# EAGLE design DomOS V2 (EAGLE 6.5.0)
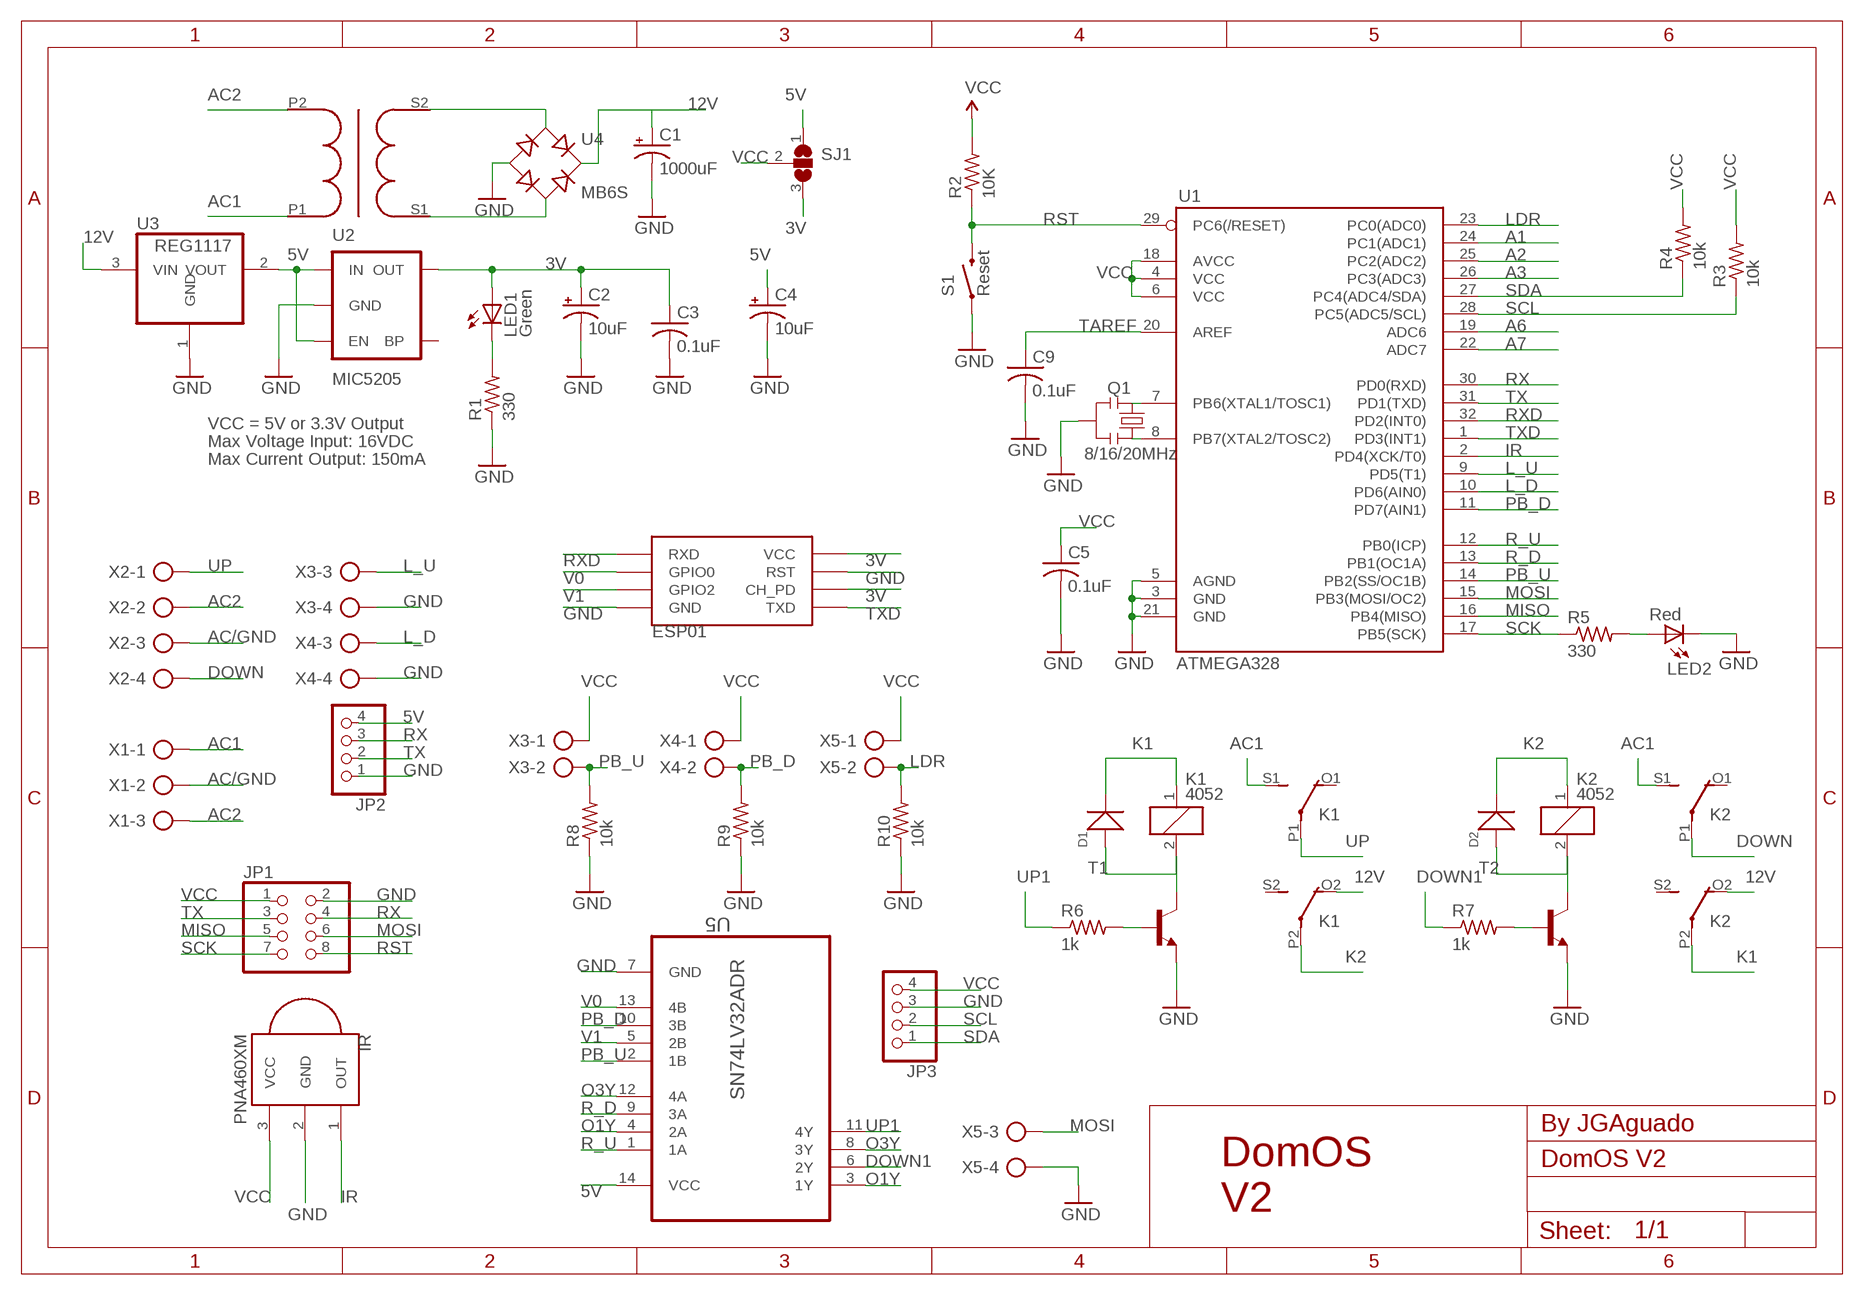
[diagram p0: schematic, sheet 1]

## Parts
C1  1000uF  CPOL-US140CLH-0810  [140CLH-0810]
C2  10uF  CAP_POL1206  [EIA3216]
C3  0.1uF  C-USC1206  [C1206]
C4  10uF  CAP_POL1206  [EIA3216]
C5  0.1uF  C-USC1206  [C1206]
C9  0.1uF  C-USC1206  [C1206]
D1  SMD-DIODE-SWITCHING-75V-150MA(D1206)  [LED-1206]
D2  SMD-DIODE-SWITCHING-75V-150MA(D1206)  [LED-1206]
ESP01  ESP01  [ESP01]
IR  PNA460XM  [PNA460XM]
JP1  PINHD-2X4  [2X04]
JP2  PINHD-1X4  [1X04]
JP3  PINHD-1X4  [1X04]
K1  4052  [F4052]
K2  4052  [F4052]
LED1  Green  LEDSMT1206  [1206]
LED2  Red  LEDSMT1206  [1206]
Q1  8/16/20MHz  RESONATORSMD  [RESONATOR-SMD]
R1  330  R-US_R1206  [R1206]
R2  10K  R-US_R1206  [R1206]
R3  10k  R-US_R1206  [R1206]
R4  10k  R-US_R1206  [R1206]
R5  330  R-US_R1206  [R1206]
R6  1k  R-US_R1206  [R1206]
R7  1k  R-US_R1206  [R1206]
R8  10k  R-US_R1206  [R1206]
R9  10k  R-US_R1206  [R1206]
R10  10k  R-US_R1206  [R1206]
S1  Reset  SWITCH-MOMENTARY-2SMD-4  [TACTILE_SWITCH_TALL]
SJ1  SJ2W  [SJ_2]
T1  BC817-16-NPN-SOT23-BEC  [SOT23-BEC]
T2  BC817-16-NPN-SOT23-BEC  [SOT23-BEC]
U1  ATMEGA328  ATMEGA168  [TQFP32-08]
U2  MIC5205  V_REG_LDOSMD  [SOT23-5]
U3  REG1117  [SOT223]
U4  MB6S  [SOIC-4]
U5  SN74LV32ADR  SN74S32D  [SOIC127P600X175-14N]
U$1  TRANSFORMADOR_PE3010-M  [TRANSFORMADOR_PE3010-M]
X1  AK500/3  [AK500/3]
X2  AK500/4  [AK500/4]
X3  AK500/4  [AK500/4]
X4  AK500/4  [AK500/4]
X5  AK500/4  [AK500/4]

## Nets
3V: C2.A(+) C3.1 ESP01.CH_PD ESP01.VCC LED1.A SJ1.3 U2.5(OUT)
5V: C4.A(+) JP2.4 SJ1.1 U2.1(IN) U2.3(EN) U3.2(VOUT) U5.14(VCC)
12V: C1.+ K1.O2(3:O) K2.O2(3:O) U3.3(VIN) U4.+
A1: U1.24(PC1(ADC1))
A2: U1.25(PC2(ADC2))
A3: U1.26(PC3(ADC3))
A6: U1.19(ADC6)
A7: U1.22(ADC7)
AC1: K1.S1(2:S) K2.S1(2:S) U$1.P1 X1.1
AC2: U$1.P2 X1.3 X2.2
AC/GND: X1.2 X2.3
DOWN: K2.P1(2:P) X2.4
DOWN1: R7.1 U5.6(2Y)
GND: C1.- C2.C(-) C3.2 C4.C(-) C5.2 C9.2 ESP01.GND ESP01.RST IR.2(GND) JP1.2 JP2.1 JP3.3 LED2.C Q1.2 R1.1 R8.1 R9.1 R10.1 S1.A2 T1.E T2.E U1.3(GND) U1.5(AGND) U1.21(GND) U2.2(GND) U3.1(GND) U4.- U5.7(GND) X3.4 X4.4 X5.4
IR: IR.1(OUT) U1.2(PD4(XCK/T0))
K1: D1.- K1.1 K2.P2(3:P)
K2: D2.- K1.P2(3:P) K2.1
L_D: U1.10(PD6(AIN0)) X4.3
L_U: U1.9(PD5(T1)) X3.3
LDR: R10.2 U1.23(PC0(ADC0)) X5.2
MISO: JP1.5 U1.16(PB4(MISO))
MOSI: JP1.6 U1.15(PB3(MOSI/OC2)) X5.3
N$1: U4.~1(AC1) U$1.S2
N$2: U4.~2(AC2) U$1.S1
N$3: D1.+ K1.2 T1.C
N$5: Q1.3 U1.8(PB7(XTAL2/TOSC2))
N$6: Q1.1 U1.7(PB6(XTAL1/TOSC1))
N$7: LED2.A R5.2
N$8: LED1.C R1.2
N$9: R6.2 T1.B
N$16: D2.+ K2.2 T2.C
N$17: R7.2 T2.B
O1Y: U5.3(1Y) U5.4(2A)
O3Y: U5.8(3Y) U5.12(4A)
PB_D: R9.2 U1.11(PD7(AIN1)) U5.10(3B) X4.2
PB_U: R8.2 U1.14(PB2(SS/OC1B)) U5.2(1B) X3.2
R_D: U1.13(PB1(OC1A)) U5.9(3A)
R_U: U1.12(PB0(ICP)) U5.1(1A)
RST: JP1.8 R2.1 S1.B2 U1.29(PC6(/RESET))
RX: JP1.4 JP2.3 U1.30(PD0(RXD))
RXD: ESP01.RX(RXD) U1.32(PD2(INT0))
SCK: JP1.7 R5.1 U1.17(PB5(SCK))
SCL: JP3.2 R3.1 U1.28(PC5(ADC5/SCL))
SDA: JP3.1 R4.1 U1.27(PC4(ADC4/SDA))
TAREF: C9.1 U1.20(AREF)
TX: JP1.3 JP2.2 U1.31(PD1(TXD))
TXD: ESP01.TX(TXD) U1.1(PD3(INT1))
UP: K1.P1(2:P) X2.1
UP1: R6.1 U5.11(4Y)
V0: ESP01.GPIO0 U5.13(4B)
V1: ESP01.GPIO2 U5.5(2B)
VCC: C5.1 IR.3(VCC) JP1.1 JP3.4 R2.2 R3.2 R4.2 SJ1.2 U1.4(VCC) U1.6(VCC) U1.18(AVCC) X3.1 X4.1 X5.1
Unconnected: K1.O1(2:O) K1.S2(3:S) K2.O1(2:O) K2.S2(3:S) U2.4(BP)

## Notes on the sheet
- VCC = 5V or 3.3V Output
- Max Voltage Input: 16VDC
- Max Current Output: 150mA
- By JGAguado
- DomOS
  V2

## Library data of the parts
C1 = resistor:CPOL-US: POLARIZED CAPACITOR, American symbol
C2 C4 = SparkFun:CAP_POL: Capacitor Polarized These are standard SMD and PTH capacitors. Normally 10uF, 47uF, and 100uF in electrolytic and tantalum varieties. Always verify the external diameter of the through hole cap, it varies with capacity, voltage, and manufacturer. The EIA devices should be standard.
C3 C5 C9 = resistor:C-US: CAPACITOR, American symbol
D1 D2 = Seeed-OPL-Diode:SMD-DIODE-SWITCHING-75V-150MA(D1206): 304040005; MPN: CD1206-S01575; VALUE: 75V 150MA
ESP01 = esp8266modules:ESP01: ESP8266 Wifi module 01
IR = adafruit:PNA460XM: IR 38KHz receiver PNA4602 and related receivers http://www.ladyada.net/library/pcb/eaglelibrary.html
JP1 = pinhead:PINHD-2X4: PIN HEADER
JP2 JP3 = pinhead:PINHD-1X4: PIN HEADER
K1 K2 = relay:4052: RELAY 2 x switch, Finder; OC_FARNELL: unknown; OC_NEWARK: unknown
LED1 LED2 = led:LED: LED OSRAM: - CHIPLED LG R971, LG N971, LY N971, LG Q971, LY Q971, LO R971, LY R971 LH N974, LH R974 LS Q976, LO Q976, LY Q976 LO Q996 - Hyper CHIPLED LW Q18S LB Q993, LB Q99A, LB R99A - SideLED LS A670, LO A670, LY A670, LG A670, LP A670 LB A673, LV A673, LT A673, LW A673 LH A674 LY A675 LS A676, LA A676, LO A676, LY A676, LW A676 LS A679, LY A679, LG A679 - Hyper Micro SIDELED® LS Y876, LA Y876, LO Y876, LY Y876 LT Y87S - SmartLED LW L88C, LW L88S LB L89C, LB L89S, LG L890 LS L89K, LO L89K, LY L89K LS L896, LA L896, LO L896, LY L896 - TOPLED LS T670, LO T670, LY T670, LG T670, LP T670 LSG T670, LSP T670, LSY T670, LOP T670, LYG T670 LG T671, LOG T671, LSG T671 LB T673, LV T673, LT T673, LW T673 LH T674 LS T676, LA T676, LO T676, LY T676, LB T676, LH T676, LSB T676, LW T676 LB T67C, LV T67C, LT T67C, LS T67K, LO T67K, LY T67K, LW E67C LS E67B, LA E67B, LO E67B, LY E67B, LB E67C, LV E67C, LT E67C LW T67C LS T679, LY T679, LG T679 LS T770, LO T770, LY T770, LG T770, LP T770 LB T773, LV T773, LT T773, LW T773 LH T774 LS E675, LA E675, LY E675, LS T675 LS T776, LA T776, LO T776, LY T776, LB T776 LHGB T686 LT T68C, LB T68C - Hyper Mini TOPLED® LB M676 - Mini TOPLED Santana® LG M470 LS M47K, LO M47K, LY M47K Source: http://www.osram.convergy.de LUXEON: - LUMILED® LXK2-PW12-R00, LXK2-PW12-S00, LXK2-PW14-U00, LXK2-PW14-V00 LXK2-PM12-R00, LXK2-PM12-S00, LXK2-PM14-U00 LXK2-PE12-Q00, LXK2-PE12-R00, LXK2-PE12-S00, LXK2-PE14-T00, LXK2-PE14-U00 LXK2-PB12-K00, LXK2-PB12-L00, LXK2-PB12-M00, LXK2-PB14-N00, LXK2-PB14-P00, LXK2-PB14-Q00 LXK2-PR12-L00, LXK2-PR12-M00, LXK2-PR14-Q00, LXK2-PR14-R00 LXK2-PD12-Q00, LXK2-PD12-R00, LXK2-PD12-S00 LXK2-PH12-R00, LXK2-PH12-S00 LXK2-PL12-P00, LXK2-PL12-Q00, LXK2-PL12-R00 Source: www.luxeon.com KINGBRIGHT: KA-3528ASYC Source: www.kingbright.com
Q1 = Testing:RESONATOR: Resonator Small SMD resonator. This is the itty bitty 10/20MHz resonators with built in caps. CSTCE10M0G55 and CSTCE20M0V53. Footprint for SMD has been used in SFE production for years, and does work okay. 1:1 is an attempt to get larger fillets on the sides so it will be easier to inspect these solders in our AOI machine. The pads have been minimized to match the actual metal under the resonator. To see this relation, it includes an image import of the bottom side of the component. Imported to scale on layer 200.
R1-R10 = resistor:R-US_: RESISTOR, American symbol
S1 = Testing:SWITCH-MOMENTARY-2: Various NO switches- pushbuttons, reed, etc
SJ1 = jumper:SJ2W: SMD solder JUMPER
T1 T2 = transistor:*-NPN-: NPN Transistror BF959 corrected 2008.03.06
U1 = SparkFun:ATMEGA168
U2 = SparkFun:V_REG_LDO: Voltage Regulator LDO Standard 150mA LDO voltage regulator in SOT-23 layout. Micrel part MIC5205. BP (by-pass) pin is used to lower output noise with 470pF cap.
U3 = burr-brown:REG1117: 800mA and 1A Low Dropout (LDO) Positive Regulator 1.8V, 2.5V, 2.85V, 3.3V, 5V, and Adj; MPN: REG1117; OC_FARNELL: 1097566; OC_NEWARK: 14P6981
U4 = rectifier:MB*S: Bridge Rectifier Source: http://www.fairchildsemi.com/ds/MB/MB6S.pdf
U5 = Texas Instruments_By_element14_Batch_1:SN74S32D: IC QUAD 2IN POS-OR GATE; MPN: SN74S32D; OC_FARNELL: 1741242; OC_NEWARK: 50R6794; PACKAGE: 14-SOIC; SUPPLIER: Texas Instruments
U$1 = SpaceDIY:TRANSFORMADOR_PE3010-M
X1 = con-ptr500:AK500/3: CONNECTOR; OC_FARNELL: unknown; OC_NEWARK: unknown
X2-X5 = con-ptr500:AK500/4: CONNECTOR; OC_FARNELL: unknown; OC_NEWARK: unknown

## Net classes
1 vcc: width 0.254 mm

## Board
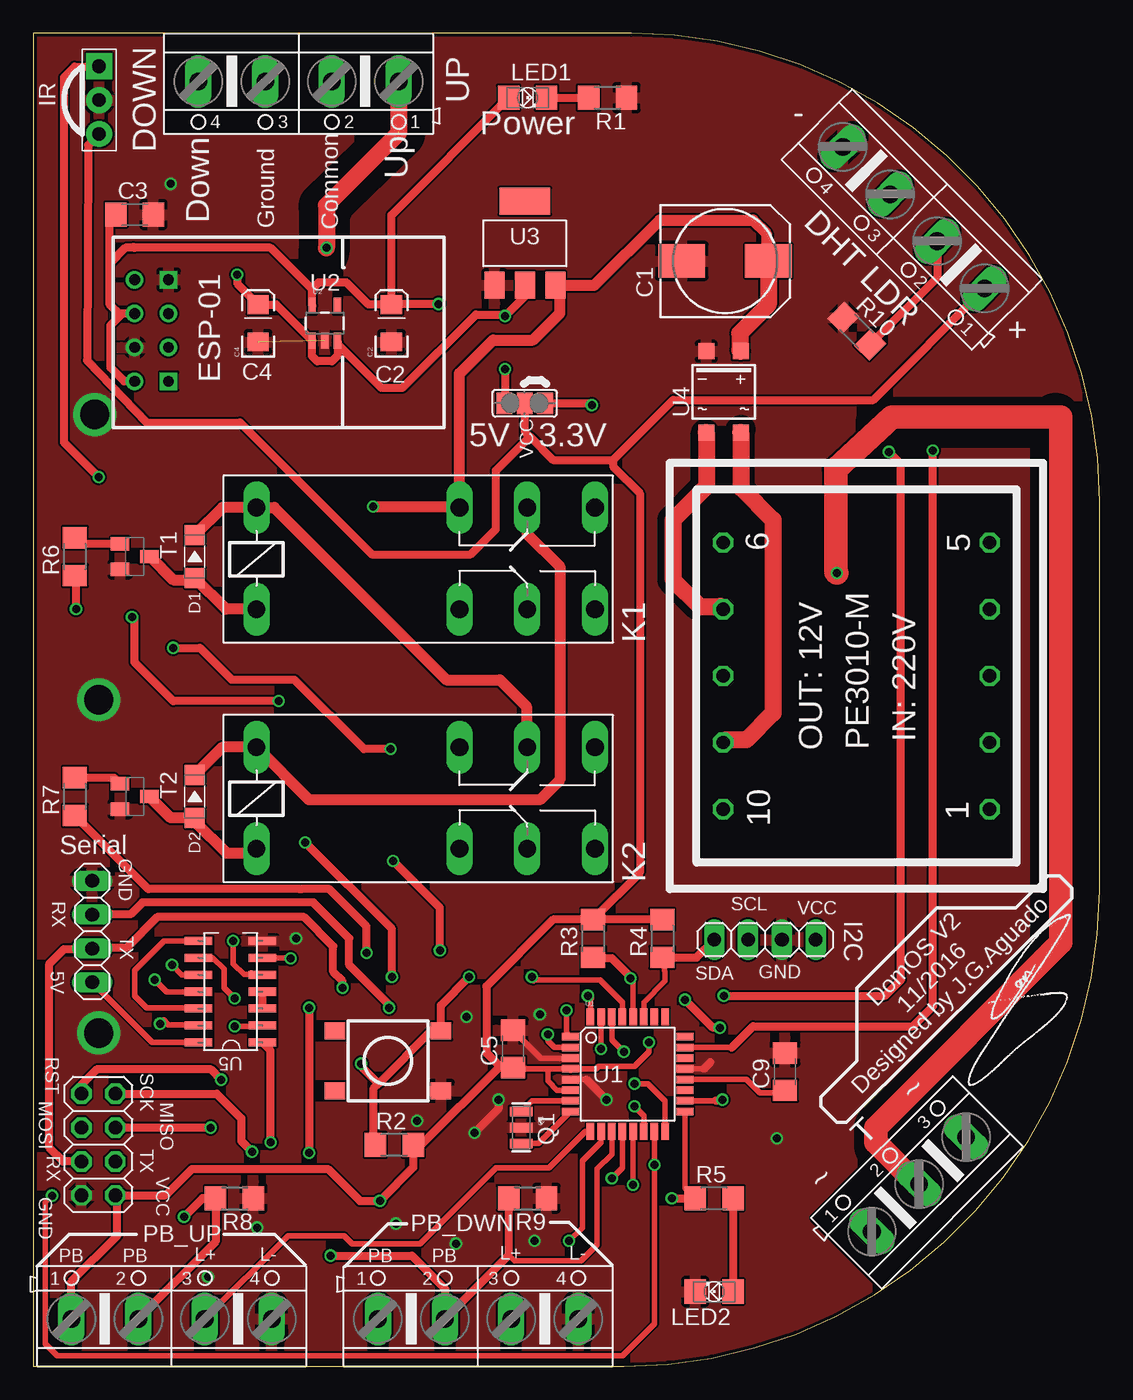
[diagram p1: board, top side]
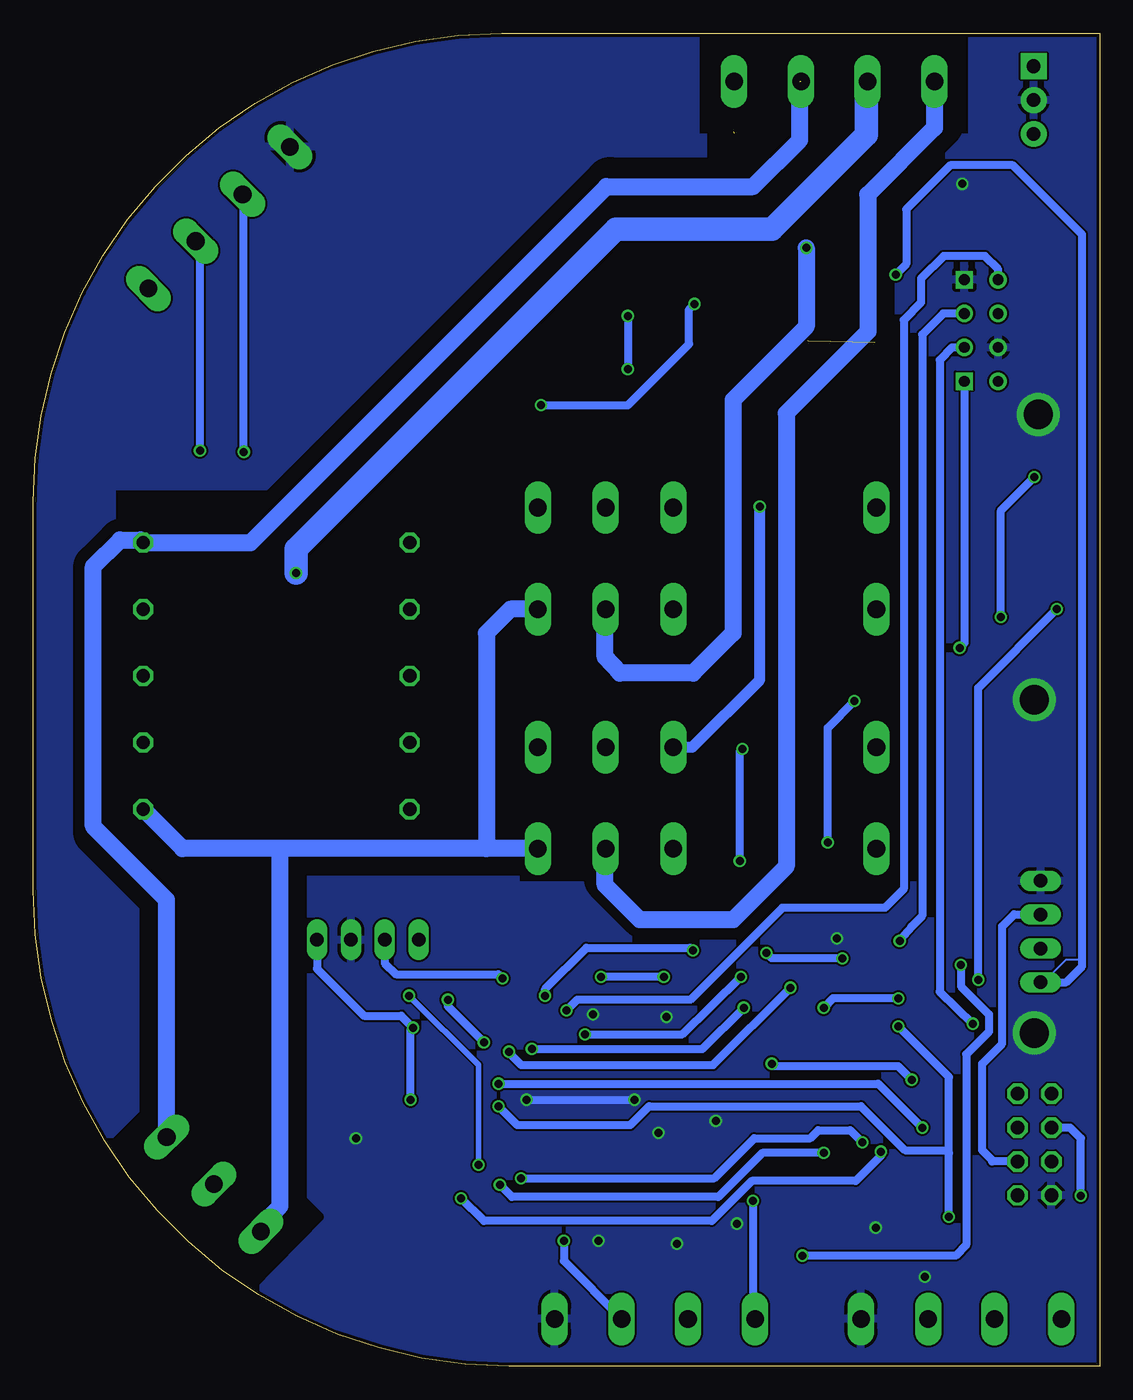
[diagram p2: board, bottom side, seen from below]

Size 80 x 100 mm. Coordinates in mm from the lower left corner, seen from the top.
Outline: 0,0 44.31,0 arc90 80,35.69 80,64.87 arc90 44.87,100 0,100 0,0
Copper layers (1*16): Top 0.035mm / dielectric 1.5mm / Bottom 0.035mm
Design rules "ITead_rule": minimum track width 6mil, minimum drill 12mil, track to track 6mil, track to pad 6mil, pad to pad 6mil, via to via 6mil, smd to smd 0mil, copper to edge 10mil, drill to drill 10mil, minimum pad ring 10mil, minimum via ring 6mil, stop-mask expansion 2mil, vias tented up to drill 100mil, thermal gap 10mil
tRestrict: area 14.2,36.4 to 43.5,48.8; area 14.2,54.4 to 43.5,66.8; area 49.8,37.9 to 73.8,65.8; area 58.5,5.9 to 74.2,21.7; area 9.9,92.5 to 29.9,99.9; 21 lines
bRestrict: area 49.8,37.8 to 73.8,65.7; area 14.2,36.4 to 43.5,48.9; area 14.2,54.3 to 43.6,66.9; area 58.5,5.9 to 74.2,21.7; area 9.9,92.5 to 30,99.9; 30 lines

### Footprints (pad centres in the part's own frame; a part is rotated, then mirrored left to right if it is on the bottom)
140CLH-0810 = smd 3.5 x 2.5: + 3.25,0; - -3.25,0
EIA3216 = smd 1.4 x 1.6: A 1.4,0; C -1.4,0
C1206 = smd 1.6 x 1.8: 1 -1.4,0; 2 1.4,0
LED-1206 = smd 1.5 x 1.5: + -1.6,0; - 1.6,0
ESP01 = drill 0.8: CH_PD -1.285,-8.178; GPIO0 1.255,-5.638; GPIO2 -1.285,-5.638; RST 1.255,-8.178; TX -3.825,-8.178; VCC 3.795,-8.178 | drill 0.8 square: GND -3.825,-5.638; RX 3.795,-5.638
PNA460XM = drill 1.016 pad 1.93 square: 1 -2.54,0 | drill 1.016 pad 1.93: 2 0,0; 3 2.54,0
2X04 = drill 1.016 octagon: 1 -3.81,-1.27; 2 -3.81,1.27; 3 -1.27,-1.27; 4 -1.27,1.27; 5 1.27,-1.27; 6 1.27,1.27; 7 3.81,-1.27; 8 3.81,1.27
1X04 = drill 1.016 long: 1 -3.81,0; 2 -1.27,0; 3 1.27,0; 4 3.81,0
F4052 = drill 1.321 long: 1 -3.81,3.81; 2 -3.81,-3.81; O1 11.43,-3.81; O2 11.43,3.81; P1 16.51,-3.81; P2 16.51,3.81; S1 21.59,-3.81; S2 21.59,3.81
1206 = smd 1.6 x 1.803: A -1.422,0; C 1.422,0
RESONATOR-SMD = smd 0.7 x 1.7: 1 -1.2,0; 2 0,0; 3 1.2,0
R1206 = smd 1.6 x 1.803: 1 -1.422,0; 2 1.422,0
TACTILE_SWITCH_TALL = smd 1.55 x 1.3: A1 -3.975,-2.25; A2 3.975,-2.25; B1 -3.975,2.25; B2 3.975,2.25
SJ_2 = smd 1.168 x 1.6: 1 -1.524,0; 2 0,0; 3 1.524,0
SOT23-BEC = smd 1 x 1.4: B -0.95,-1.1; C 0,1.1; E 0.95,-1.1
TQFP32-08 = smd 1.27 x 0.559: 1 -4.293,2.8; 2 -4.293,2; 3 -4.293,1.2; 4 -4.293,0.4; 5 -4.293,-0.4; 6 -4.293,-1.2; 7 -4.293,-2; 8 -4.293,-2.8; 17 4.293,-2.8; 18 4.293,-2; 19 4.293,-1.2; 20 4.293,-0.4; 21 4.293,0.4; 22 4.293,1.2; 23 4.293,2; 24 4.293,2.8 | smd 0.559 x 1.27: 9 -2.8,-4.293; 10 -2,-4.293; 11 -1.2,-4.293; 12 -0.4,-4.293; 13 0.4,-4.293; 14 1.2,-4.293; 15 2,-4.293; 16 2.8,-4.293; 25 2.8,4.293; 26 2,4.293; 27 1.2,4.293; 28 0.4,4.293; 29 -0.4,4.293; 30 -1.2,4.293; 31 -2,4.293; 32 -2.8,4.293
SOT23-5 = smd 0.55 x 1.2: 1 -0.95,-1.3; 2 0,-1.3; 3 0.95,-1.3; 4 0.95,1.3; 5 -0.95,1.3
SOT223 = smd 1.499 x 2.007: 1 -2.261,-3.15; 2 0.025,-3.15; 3 2.311,-3.15 | smd 3.81 x 2.007: 4 0,3.15
SOIC-4 = smd 1.2 x 1.2: + 1.3,3.05; - -1.3,3.05; ~1 -1.3,-3.05; ~2 1.3,-3.05
SOIC127P600X175-14N = smd 2.057 x 0.61: 1 -4.801,7.62; 2 -4.801,6.35; 3 -4.801,5.08; 4 -4.801,3.81; 5 -4.801,2.54; 6 -4.801,1.27; 7 -4.801,0; 8 0,0; 9 0,1.27; 10 0,2.54; 11 0,3.81; 12 0,5.08; 13 0,6.35; 14 0,7.62
TRANSFORMADOR_PE3010-M = drill 1 octagon: P1 -10,-10; P2 10,-10; P$3 10,10; P$6 -10,10; P$7 0,10; P$8 -5,-10; P$9 0,-10; P$10 5,-10; S1 -5,10; S2 5,10
AK500/3 = drill 1.321 long: 1 -5.004,0; 2 0,0; 3 5.004,0
AK500/4 = drill 1.321 long: 1 -7.518,0; 2 -2.489,0; 3 2.489,0; 4 7.518,0

### Placement (x,y rotation side)
C1  51.9,82.92 0 top
C2  26.87,78.25 90 top
C3  7.61,86.4 0 top
C4  16.87,78.25 90 top
C5  36,23.81 90 top
C9  56.4,22.09 90 top
D1  12.11,60.74 90 top
D2  12.12,42.75 90 top
ESP01  15.78,77.69 270 top
IR  4.94,94.99 270 top
JP1  4.88,16.63 90 top
JP2  4.42,32.61 270 top
JP3  54.9,32 0 top
K1  20.55,60.61 0 top
K2  20.55,42.64 0 top
LED1  37.09,95.17 0 top
LED2  51.09,5.6 180 top
Q1  36.6,17.91 270 top
R1  43.09,95.17 180 top
R2  27.09,16.6 0 top
R3  42,32.09 90 top
R4  47.2,32.09 90 top
R5  51.09,12.6 0 top
R6  3.11,60.74 90 top
R7  3.11,42.74 90 top
R8  15.09,12.6 180 top
R9  37.09,12.6 180 top
R10  61.78,77.65 315 top
S1  26.6,22.91 0 top
SJ1  36.87,72.25 0 top
T1  7.61,60.74 270 top
T2  7.61,42.75 270 top
U1  44.6,21.91 0 top
U2  21.87,78.25 0 top
U3  36.87,84.25 0 top
U4  51.79,73.1 0 top
U5  12.4,31.91 180 top
U$1  61.76,51.79 90 top
X1  66.46,13.65 45 top
X2  19.9,96.4 180 top
X3  10.37,3.55 0 top
X4  33.37,3.55 0 top
X5  66.06,86.17 135 top

### Tracks (layer width: path | path; a pad name or v marks a point on that pad's centre or on a via)
3V  (via drill 0.6)
  Top 0.61: SJ1.3 41.75,72.25 v41.9,72.1 | v30.4,79.7 26.92,79.7 C2.A | C2.A 25.15,79.65 23.5,81.3 21.4,81.3 20.9,80.8 | 20.9,80.8 20.92,80.78 U2.5 | C2.A 26.87,86.37 LED1.A | ESP01.VCC 6.8,73.89 5.8,74.9 5.8,78.1 6.55,78.85 | 6.55,78.85 6.7,79 7.58,79 ESP01.CH_PD | 20.9,80.8 17.8,83.9 7.6,83.9 | 7.6,83.9 6.9,83.9 5.7,82.7 | 5.7,82.7 5.7,79.7 6.55,78.85 | 7.51,83.99 7.6,83.9 | C3.1 5.7,86.4 5.7,82.7
  Bottom 0.61: v41.9,72.1 35.4,72.1 30.8,76.7 30.8,79.3 v30.4,79.7
5V  (via drill 0.6)
  Top 0.406: 11.59,24.3 8.92,24.3 JP2.4
  Top 0.61: U3.2 36.9,80.3 v35.4,78.8 35.3,78.9 33.2,78.9 27.7,73.4 26.1,73.4 22.82,76.68 U2.3 22.82,75.82 22.4,75.4 21.3,75.4 20.9,75.8 20.9,76.93 U2.1 18.22,79.65 C4.A 15.3,81.22 v15.3,81.9 | v35.4,74.8 35.4,72.3 SJ1.1 | 11.59,24.3 U5.14
  Bottom 0.152: JP2.4 3.81,29.21 2.54,30.48 1.3,30.48 1.27,30.48
  Bottom 0.61: v35.4,78.8 v35.4,74.8 | 4.4,28.8 2.5,28.8 1.3,30 1.3,30.48 1.3,84.9 6.5,90.1 11.2,90.1 14.5,86.8 14.5,82.7 v15.3,81.9
12V  (via drill 0.6)
  Top 0.813: C1.+ 55,83.07 55,85 54,86 47,86 42.1,81.1 U3.3 39.5,80.78 39.5,79 37.5,77 34.5,77 31.98,74.48 K1.O2 31.9,64.5 v25.5,64.5
  Top 1.27: C1.+ 55.15,79.65 53,77.5 53,76.24 U4.+
  Bottom 0.813: K2.O2 30.55,46.45 25.5,51.5 v25.5,64.5
AC1
  Bottom 1.27: K2.S1 46,38.83 | 46,38.83 61.5,38.83 | 61.5,38.83 68.8,38.83 U$1.P1 | K1.S1 44.2,56.8 46,55 46,38.83 | X1.1 62.92,10.58 61.5,12 61.5,38.83
AC2  (1 unrouted)
  Bottom 1.27: X1.3 70,35 75.5,40.5 75.5,60 73.5,62 71.97,62 U$1.P2 63.71,61.79 37,88.5 26,88.5 22.5,92 22.5,96.42
AC/GND  (via drill 0.6)
  Top 1.778: X1.2 66.35,13.65 63.2,16.8 63.2,17.9 77.1,31.8 77.1,71.2 64.4,71.2 60.2,67.3 60.2,59.6 v60.3,59.5
  Bottom 1.778: v60.3,59.5 60.3,61.3 36.3,85.3 24.6,85.3 17.5,92.4 17.5,96.31 X2.3
DOWN
  Bottom 1.27: K2.P1 37.1,37.99 37.1,36.1 34.5,33.5 27.5,33.5 23.5,37.5 23.5,71.5 17.37,77.63 17.4,77.67 17.4,87.9 12.38,92.92 X2.4
DOWN1  (via drill 0.6)
  Top 0.406: U5.6 19.26,30.64
  Top 0.61: 19.26,30.64 v19.3,30.6 | v25,31 24.9,31 25,31.1 25,33 22.2,35.8 20.1,35.8 20,35.8 8.63,35.8 R7.1
  Bottom 0.61: v19.3,30.6 24.6,30.6 v25,31
GND  (via drill 0.6, 2.2 pad 2.54)  (1 unrouted)
  Top 0.406: U1.21 50.31,22.31 | U1.3 38.1,23.11 C5.2 | U1.5 41.49,21.51
  Top 0.61: 50.31,22.31 50.8,22.8 | 41.49,21.51 v43,20 | v34.9,20 34.9,19.3 v33.1,17.5
  Bottom 0.61: v43,20 v34.9,20
  other vias: 16.8,10.4 28.8,18.4 13.1,6.7 55.8,17.1 37.6,9.4 31.7,9.2 38,26.4 19.7,32.1 10.3,88.7 27.2,10.7 4.9,25 4.9,50 4.6,71.4 32.5,26.2
  pour Bottom: 0,100 0,0 44.3,0 arc90 80,35.7 80,65 arc90 45,100
  pour Top: 0,100 0,0 44.5,0 44.7,0 arc90 80,35.3 80,65 arc90 45,100
IR  (via drill 0.6)
  Top 0.406: U1.2 39.09,23.91 38.6,24.4 v38.6,24.9
  Top 0.61: v26.9,29.2 26.9,32.8 v20.4,39.3 | v18.4,49.9 10.5,49.9 7.6,52.8 7.6,56 v7.4,56.2 | v4.9,66.7 2.3,69.3 2.3,96.7 3.1,97.5 4.01,97.5 IR.1
  Bottom 0.61: v38.6,24.9 31.3,24.9 v26.9,29.2 | v20.4,39.3 20.4,47.9 v18.4,49.9 | v7.4,56.2 7.4,64.2 v4.9,66.7
K1
  Top 0.813: D1.- 14.19,64.42 K1.1 18.08,64.42 31,51.5 35,51.5 37,49.5 37,46.51 K2.P2
K2
  Top 0.813: K1.P2 37.06,62.44 39.5,60 39.5,44 38,42.5 20.69,42.5 K2.1 14.22,46.45 D2.-
L_D  (via drill 0.6)
  Top 0.406: U1.10 42.6,16.8 41.2,15.4 41.2,10.4 v40.2,9.4
  Bottom 0.61: v40.2,9.4 40.2,7.89 X4.3
L_U
  Top 0.406: U1.9 41.42,17.62 38.7,14.9 34.7,14.9 29,9.2 23.9,9.2 23.3,9.8 19.11,9.8 | 19.11,9.8 19.1,9.8 | 19.11,9.8 X3.3
LDR  (via drill 0.6)
  Top 0.406: U1.23 52.41,23.91
  Top 0.61: X5.2 67.82,81.68 R10.2 | 52.41,23.91 54,25.5 66,25.5 67.5,27 v67.5,68.7
  Bottom 0.61: v67.5,68.7 67.5,84.09 X5.2
MISO  (via drill 0.6)
  Top 0.406: U1.16 47.4,19.9 46.1,21.2 v45.1,21.2
  Top 0.61: v13.3,17.9 JP1.5
  Bottom 0.61: v45.1,21.2 16.6,21.2 v13.3,17.9
MOSI  (via drill 0.6)
  Top 0.406: v46.6,15.1 U1.15 46.6,3.2 44.2,0.8 1.8,0.8 0.9,1.7 0.9,12.3 v1.4,12.8
  Top 0.61: v51.8,27.8 63.9,27.8 65.1,29 65.1,67.7 v64.2,68.6
  Bottom 0.406: v46.6,15.1 46.6,22.6 v51.8,27.8
  Bottom 0.61: v64.2,68.6 64.2,87.83 X5.3 | v1.4,12.8 1.4,17.1 2.2,17.9 JP1.6
N$1
  Top 1.27: U4.~1 50.49,65.99 48,63.5 48,59 50,57 51.55,57 U$1.S2
N$2
  Top 1.27: U4.~2 53.09,65.91 55.5,63.5 55.5,49 53.5,47 51.97,47 U$1.S1
N$3
  Top 0.813: K1.2 14.45,56.8 D1.+ 11.97,59 10.5,59 8.76,60.74 T1.C
N$5
  Top 0.406: Q1.3 37.91,16.71 U1.8
N$6
  Top 0.406: U1.7 37.4,19.91 Q1.1
N$7
  Top 0.61: R5.2 LED2.A
N$8
  Top 0.61: LED1.C R1.2
N$9
  Top 0.61: T1.B 3.58,61.69 R6.2
N$16
  Top 0.813: K2.2 16.41,38.5 14.5,38.5 12.12,40.88 D2.+ 10.31,41.15 T2.C
N$17
  Top 0.61: R7.2 6.04,44.16 T2.B
O1Y
  Top 0.61: U5.3 U5.4
O3Y
  Top 0.406: U5.8 9.81,31.91 7.6,29.7 7.6,27.8 8.5,26.9 11.53,26.9 U5.12
PB_D  (via drill 0.6)
  Top 0.406: U5.10 11.13,29.37 v10.4,30.1 | U1.11 43.4,15.9 42.3,14.8 42.3,9.1 41.1,7.9 36.1,7.9 35.67,8.34
  Top 0.61: R9.2 35.67,8.34 X4.2 30.9,3.57 30.9,5.8 28.4,8.3 v22.3,8.3
  Bottom 0.61: v10.4,30.1 10.4,28.5 8.3,26.4 8.3,25.1 10,23.4 10,9.1 10.8,8.3 v22.3,8.3
PB_U  (via drill 0.6)
  Top 0.406: v15.1,25.5 16.34,25.5 U5.2 | U1.14 45.8,18.8 v45.1,19.5
  Top 0.61: X3.2 13.67,9.34 R8.2 12.7,12.6 v11.3,11.2
  Bottom 0.61: v11.3,11.2 11.3,16 | 11.3,16 11.3,21.7 v15.1,25.5 | v45.1,19.5 43.7,18.1 35.2,18.1 33.8,19.5 17.9,19.5 14.6,16.2 11.5,16.2 11.3,16
R_D  (via drill 0.6)
  Top 0.406: v45,13.6 U1.13 | U5.9 13.46,30.64 14.3,29.8 14.3,28.4 v15.1,27.6
  Top 0.61: v20.7,26.9 v20.7,16
  Bottom 0.61: v15.1,27.6 20,27.6 v20.7,26.9 | v20.7,16 25.3,16 28.6,12.7 44.1,12.7 v45,13.6
R_U  (via drill 0.6)
  Top 0.406: U1.12 44.2,14.9 v43.4,14.1
  Top 0.61: v17.8,16.8 17.8,23.69 U5.1
  Bottom 0.61: v43.4,14.1 28.9,14.1 25.9,17.1 21.7,17.1 21.1,17.7 18.7,17.7 v17.8,16.8
RST  (via drill 0.6)
  Top 0.406: 37.5,29 42.5,29 44.2,27.3 U1.29
  Top 0.61: v32.7,29.2 30.57,27.07 S1.B2 29.86,25.16 25.9,21.2 | v37.4,29.2 37.5,29 | 25.9,21.2 25.5,20.8 25.5,16.77 R2.1 | JP1.8 3.61,21.11 4.8,22.3 13.3,22.3 v14.1,21.5 | v24.6,22.7 24.6,22.5 25.9,21.2
  Bottom 0.61: v32.7,29.2 v37.4,29.2 | v14.1,21.5 15.1,22.5 24.4,22.5 v24.6,22.7
RX  (via drill 0.6)
  Top 0.406: U1.30 43.4,24.5 v44.3,23.6
  Top 0.61: v23.2,28.4 23.2,28.9 22.5,29.6 22.5,31.5 20.3,33.7 9.3,33.7 7,31.4 4.48,31.4 JP2.3 | 4.76,31 JP2.3 | JP1.4 2.24,15.36 1.2,16.4 1.2,30.2 2.3,31.3 4.38,31.3 JP2.3
  Bottom 0.61: v23.2,28.4 29,22.6 43.4,22.6 44.3,23.5 v44.3,23.6
RXD  (via drill 0.6)
  Top 0.406: U1.32 41.8,27.6
  Top 0.61: v10.5,53.9 12.5,53.9 14.9,51.5 19.6,51.5 24.8,46.3 v26.8,46.3 | 41.8,27.6 v41.6,27.8 | v30.5,31.2 30.5,34.4 v27,37.9
  Bottom 0.61: ESP01.RX 10.14,54.26 v10.5,53.9 | v41.6,27.8 41.6,28.3 38.5,31.4 30.7,31.4 v30.5,31.2 | v27,37.9 27,46.1 v26.8,46.3
SCK  (via drill 0.6)
  Top 0.406: U1.17 48.89,13.38 R5.1
  Top 0.61: JP1.7 13.76,20.44 15.6,18.6 15.6,16.9 v16.4,16.1 | v47.9,12.6 R5.1
  Bottom 0.61: v16.4,16.1 16.4,15.8 18.3,13.9 26.1,13.9 29.1,10.9 46.2,10.9 v47.9,12.6
SCL  (via drill 0.6)
  Top 0.406: U1.28 45,28.9 v44.8,29.1
  Top 0.61: v44.8,29.1 44.8,29.2 43.4,30.6 42.07,30.6 R3.1
  Bottom 0.61: JP3.2 53.63,30.23 52.8,29.4 45.1,29.4 v44.8,29.1
SDA
  Top 0.406: U1.27 45.8,27.3 47.4,28.9 47.4,29.5 R4.1
  Top 0.61: R4.1 49.76,30.67 JP3.1
TAREF
  Top 0.406: U1.20 53.49,21.51 54.5,20.5 56.21,20.5
  Top 0.61: 56.21,20.5 C9.1
TX  (via drill 0.6)
  Top 0.406: U1.31 v42.6,23.8
  Top 0.61: v26.7,26.9 26.7,27.1 23.7,30.1 23.7,32.1 21,34.8 8.2,34.8 7.3,33.9 4.44,33.9 JP2.2
  Bottom 0.61: JP1.3 8.06,15.36 8.06,15.46 8.8,16.2 8.8,22.7 7.3,24.2 7.3,33 6.4,33.9 4.44,33.9 JP2.2 | v42.6,23.8 29.8,23.8 v26.7,26.9
TXD  (via drill 0.6)
  Top 0.406: v40,26.7 40,25.02 U1.1
  Bottom 0.61: ESP01.TX 7.6,82.3 8.6,83.3 11.7,83.3 13.4,81.6 13.4,79.8 14.7,78.5 14.7,35.8 16.1,34.4 23.8,34.4 30.7,27.5 39.2,27.5 v40,26.7
UP  (via drill 0.6)  (1 unrouted)
  Top 1.27: 27.4,92.5 22,87.1 v22,83.9 | X2.1 27.42,92.62
  Bottom 1.27: v22,83.9 22,78 27.5,72.5 27.5,55 30.5,52 36,52 37.1,53.2 37.1,56.56 K1.P1
UP1  (via drill 0.6)
  Top 0.406: U5.11 10,28.1 v9.1,29
  Top 0.61: v3.2,56.8 3.2,59.23 R6.1
  Bottom 0.61: v9.1,29 9.1,50.9 v3.2,56.8
V0  (via drill 0.6)
  Top 0.406: 9.8,25.9 10.1,25.6 11.56,25.6 U5.13
  Top 0.61: v9.5,25.7 9.8,25.9
  Bottom 0.61: ESP01.GPIO0 11.06,76.44 12,75.5 12,28.1 v9.5,25.7
V1  (via drill 0.6)
  Top 0.406: v15,31.9 15,30.2 15.8,29.4 16.37,29.4
  Top 0.61: 16.37,29.4 U5.5
  Bottom 0.61: ESP01.GPIO2 11.72,78.97 13.3,77.4 13.3,33.8 14.1,33 15,32 v15,31.9
VCC  (via drill 0.6)
  Top 0.406: U1.4 38.5,22.31 | 38.5,22.31 36.8,22.31 | U1.6 39.29,20.71 38.6,21.4 38.6,22.21 38.5,22.31 | U1.18 51.21,19.91 | v46.2,24.3 46.2,23.6 45.1,22.5 42.4,22.5 42.2,22.3 U1.4
  Top 0.61: SJ1.2 36.87,70.13 37.25,69.75 | 37.25,69.75 39,68 43.5,68 | 43.5,68 48,72.5 63.02,72.5 X5.1 | 43.5,68 43.5,67.5 45.5,65.5 45.5,37.01 R3.2 | R3.2 R4.2 47.41,33.5 | R3.2 39.01,33.51 34,28.5 34,23.5 35,22.5 | 35,22.5 36.59,22.5 C5.1 36.8,22.31 | IR.3 4.1,91.61 4.1,91.2 4.04,75.46 8.5,70.8 15.5,70.8 25.4,60.9 32.8,60.9 34.7,62.8 34.7,67.2 37.25,69.75 | 35,22.5 29.1,16.6 R2.2 28.51,14.91 v26,12.4 24.5,12.4 22.1,14.8 11.9,14.8 9.92,12.82 JP1.1 6.3,12.67 6.3,9.8 2.85,6.35 X3.1 | 51.21,19.91 v51.7,20 | v51.5,25.4 51,25.4 v48.9,27.5 | U1.4
  Bottom 0.61: v26,12.4 26,3.7 X4.1 | v51.7,20 51.7,25.2 v51.5,25.4 52.4,26.3 55.2,26.3 58.71,29.81 JP3.4 | v48.9,27.5 48.9,27 v46.2,24.3

### Text on the board
tPlace: Up | Down | Ground | Common | ESP-01 | VCC | 6 | 5 | OUT: 12V | PE3010-M | IN: 220V | 10 | 1 | Serial | GND | SCL | RX | VCC | I2C | TX | SDA | GND | 5V | DomOS V2 / 11/2016 / Designed by J.G.Aguado | RST | SCK | U1 | MOSI | MISO | ~ | RX | TX | T | VCC | GND | ~ | PB_DWN | PB_UP | PB | PB | L+ | L- | PB | PB | L+ | L-
tNames: UP | Power | - | DOWN | DHT | U2 | LDR | + | C4 | C2 | 5V | 3.3V | Q1